# EAGLE schematic 0x6Top (EAGLE 7.3.0)
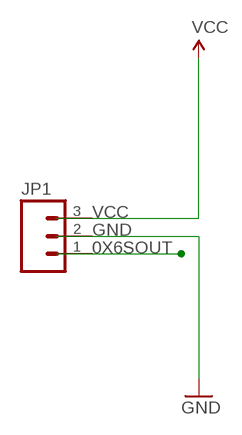
[diagram p0: schematic, sheet 1]

## Parts
JP1  M03PTH  [1X03]

## Nets
0X6SOUT: JP1.1
GND: JP1.2
VCC: JP1.3

## Library data of the parts
JP1 = SparkFun-Connectors:M03: Header 3 Standard 3-pin 0.1" header. Use with straight break away headers (SKU : PRT-00116), right angle break away headers (PRT-00553), swiss pins (PRT-00743), machine pins (PRT-00117), and female headers (PRT-00115). Molex polarized connector foot print use with SKU : PRT-08232 with associated crimp pins and housings.